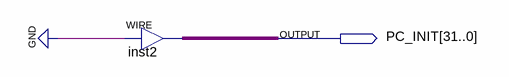
[diagram p0: schematic sheet]
// Quartus schematic PC_INIT.bdf as structural Verilog: 1 symbols, 1 pins
module PC_INIT (
  output [31:0] PC_INIT
);

  assign PC_INIT = {32{1'b0}};  // WIRE inst2
endmodule
